# EAGLE design secondsBoard (EAGLE 5.11)
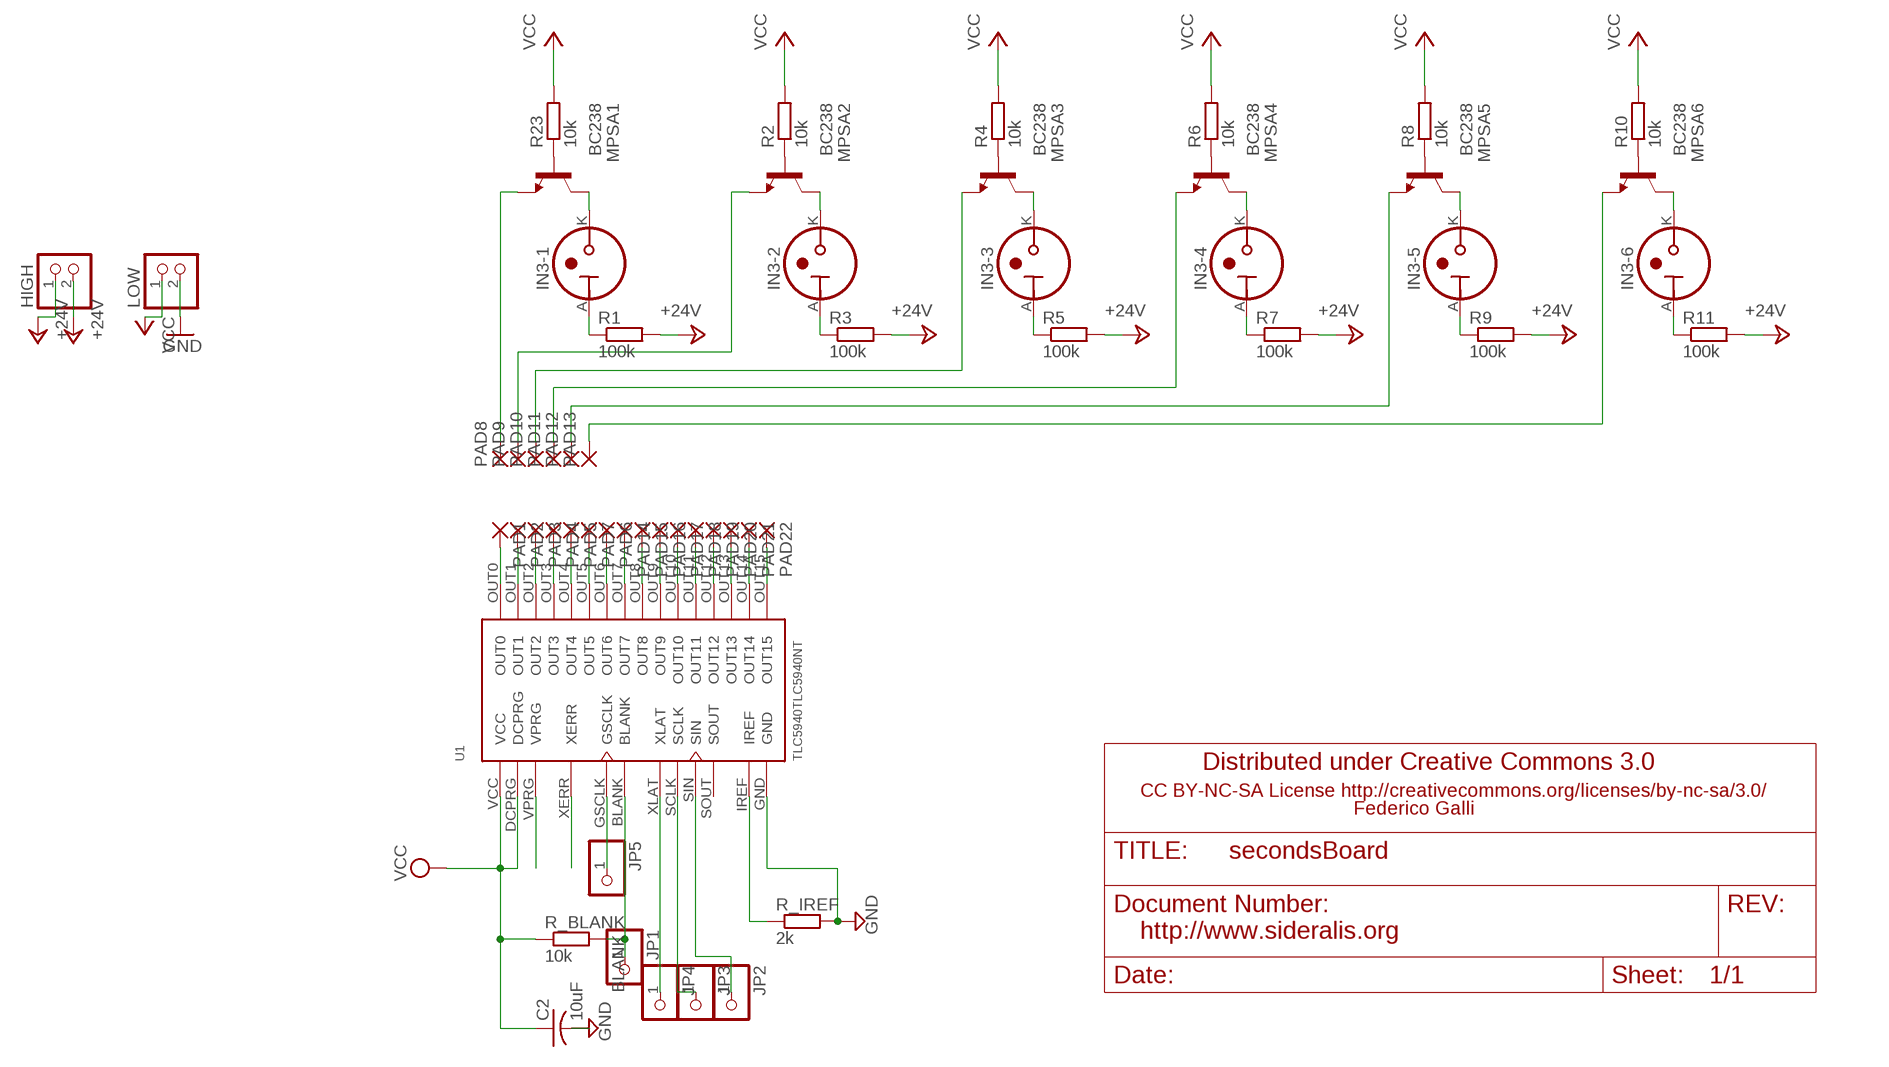
[diagram p0: schematic, sheet 1]

## Parts
C2  10uF  C-US025-025X050  [C025-025X050]
HIGH  PINHD-1X2  [1X02]
IN3-1  IN-3  [IN-3]
IN3-2  IN-3  [IN-3]
IN3-3  IN-3  [IN-3]
IN3-4  IN-3  [IN-3]
IN3-5  IN-3  [IN-3]
IN3-6  IN-3  [IN-3]
JP1  PINHD-1X1  [1X01]
JP2  PINHD-1X1  [1X01]
JP3  PINHD-1X1  [1X01]
JP4  PINHD-1X1  [1X01]
JP5  PINHD-1X1  [1X01]
LOW  PINHD-1X2  [1X02]
MPSA1  BC238  [TO92]
MPSA2  BC238  [TO92]
MPSA3  BC238  [TO92]
MPSA4  BC238  [TO92]
MPSA5  BC238  [TO92]
MPSA6  BC238  [TO92]
PAD1  2,15/1,0  [2,15/1,0]
PAD2  2,15/1,0  [2,15/1,0]
PAD3  2,15/1,0  [2,15/1,0]
PAD4  2,15/1,0  [2,15/1,0]
PAD5  2,15/1,0  [2,15/1,0]
PAD6  2,15/1,0  [2,15/1,0]
PAD7  2,15/1,0  [2,15/1,0]
PAD8  2,15/1,0  [2,15/1,0]
PAD9  2,15/1,0  [2,15/1,0]
PAD10  2,15/1,0  [2,15/1,0]
PAD11  2,15/1,0  [2,15/1,0]
PAD12  2,15/1,0  [2,15/1,0]
PAD13  2,15/1,0  [2,15/1,0]
PAD14  2,15/1,0  [2,15/1,0]
PAD15  2,15/1,0  [2,15/1,0]
PAD16  2,15/1,0  [2,15/1,0]
PAD17  2,15/1,0  [2,15/1,0]
PAD18  2,15/1,0  [2,15/1,0]
PAD19  2,15/1,0  [2,15/1,0]
PAD20  2,15/1,0  [2,15/1,0]
PAD21  2,15/1,0  [2,15/1,0]
PAD22  2,15/1,0  [2,15/1,0]
R1  100k  R-EU_0207/7  [0207/7]
R2  10k  R-EU_0207/7  [0207/7]
R3  100k  R-EU_0207/7  [0207/7]
R4  10k  R-EU_0207/7  [0207/7]
R5  100k  R-EU_0207/7  [0207/7]
R6  10k  R-EU_0207/7  [0207/7]
R7  100k  R-EU_0207/7  [0207/7]
R8  10k  R-EU_0207/7  [0207/7]
R9  100k  R-EU_0207/7  [0207/7]
R10  10k  R-EU_0207/7  [0207/7]
R11  100k  R-EU_0207/7  [0207/7]
R23  10k  R-EU_0207/7  [0207/7]
R_BLANK  10k  R-EU_0207/7  [0207/7]
R_IREF  2k  R-EU_0207/7  [0207/7]
U1  TLC5940TLC5940NT  [DIL28-3]

## Nets
+24V: HIGH.1 HIGH.2 R1.2 R3.2 R5.2 R7.2 R9.2 R11.2
BLANK: JP1.1 R_BLANK.2 U1.BLANK
GND: C2.2 LOW.2 R_IREF.2 U1.GND U1.VPRG
GSCLK: JP5.1 U1.GSCLK
N$1: IN3-1.K MPSA1.3(C)
N$2: IN3-1.A R1.1
N$3: U1.XERR
N$4: R_IREF.1 U1.IREF
N$5: MPSA2.2(B) R2.1
N$6: IN3-2.K MPSA2.3(C)
N$7: IN3-2.A R3.1
N$8: MPSA3.2(B) R4.1
N$9: IN3-3.K MPSA3.3(C)
N$10: IN3-3.A R5.1
N$11: MPSA4.2(B) R6.1
N$12: IN3-4.K MPSA4.3(C)
N$13: IN3-4.A R7.1
N$14: MPSA5.2(B) R8.1
N$15: IN3-5.K MPSA5.3(C)
N$16: IN3-5.A R9.1
N$17: MPSA6.2(B) R10.1
N$18: IN3-6.K MPSA6.3(C)
N$19: IN3-6.A R11.1
N$20: PAD1.1(P) U1.OUT0
N$21: PAD2.1(P) U1.OUT1
N$22: PAD3.1(P) U1.OUT2
N$23: PAD4.1(P) U1.OUT3
N$24: PAD5.1(P) U1.OUT4
N$25: PAD7.1(P) U1.OUT5
N$26: PAD22.1(P) U1.OUT15
N$27: PAD6.1(P) U1.OUT6
N$28: PAD14.1(P) U1.OUT7
N$53: MPSA1.2(B) R23.1
OUT1_BLUE: MPSA3.1(E) PAD10.1(P)
OUT1_GREEN: MPSA1.1(E) PAD8.1(P)
OUT1_GREEN1: MPSA2.1(E) PAD9.1(P)
OUT2_BLUE: MPSA6.1(E) PAD13.1(P)
OUT2_GREEN: MPSA4.1(E) PAD11.1(P)
OUT2_RED: MPSA5.1(E) PAD12.1(P)
OUT3_BLUE: PAD15.1(P) U1.OUT8
OUT4_BLUE: PAD18.1(P) U1.OUT11
OUT4_GREEN: PAD16.1(P) U1.OUT9
OUT4_RED: PAD17.1(P) U1.OUT10
OUT5_BLUE: PAD21.1(P) U1.OUT14
OUT5_GREEN: PAD19.1(P) U1.OUT12
OUT5_RED: PAD20.1(P) U1.OUT13
SCLK: JP3.1 U1.SCLK
SIN: JP2.1 U1.SIN
VCC: C2.1 LOW.1 R2.2 R4.2 R6.2 R8.2 R10.2 R23.2 R_BLANK.1 U1.DCPRG U1.VCC
XLAT: JP4.1 U1.XLAT
Unconnected: U1.SOUT

## Notes on the sheet
- Distributed under Creative Commons 3.0
- CC BY-NC-SA License http://creativecommons.org/licenses/by-nc-sa/3.0/
- Federico Galli
- http://www.sideralis.org

## Library data of the parts
C2 = adafruit:C-US: CAPACITOR, American symbol
HIGH LOW = pinhead:PINHD-1X2: PIN HEADER
IN3-1-IN3-6 = russian-nixies:IN-3: IN-3: nixie bulb
JP1-JP5 = adafruit:PINHD-1X1: Pin header 1x1 for 0.1" spacing With round pins
MPSA1-MPSA6 = transistor-npn:BC238: NPN Transistor
PAD1-PAD22 = wirepad:2,15/1,0: THROUGH-HOLE PAD
R1-R11 R23 = resistor:R-EU_: RESISTOR, European symbol
R_BLANK R_IREF = rcl:R-EU_: RESISTOR, European symbol
U1 = TLC5940NT:TLC5940

## Board
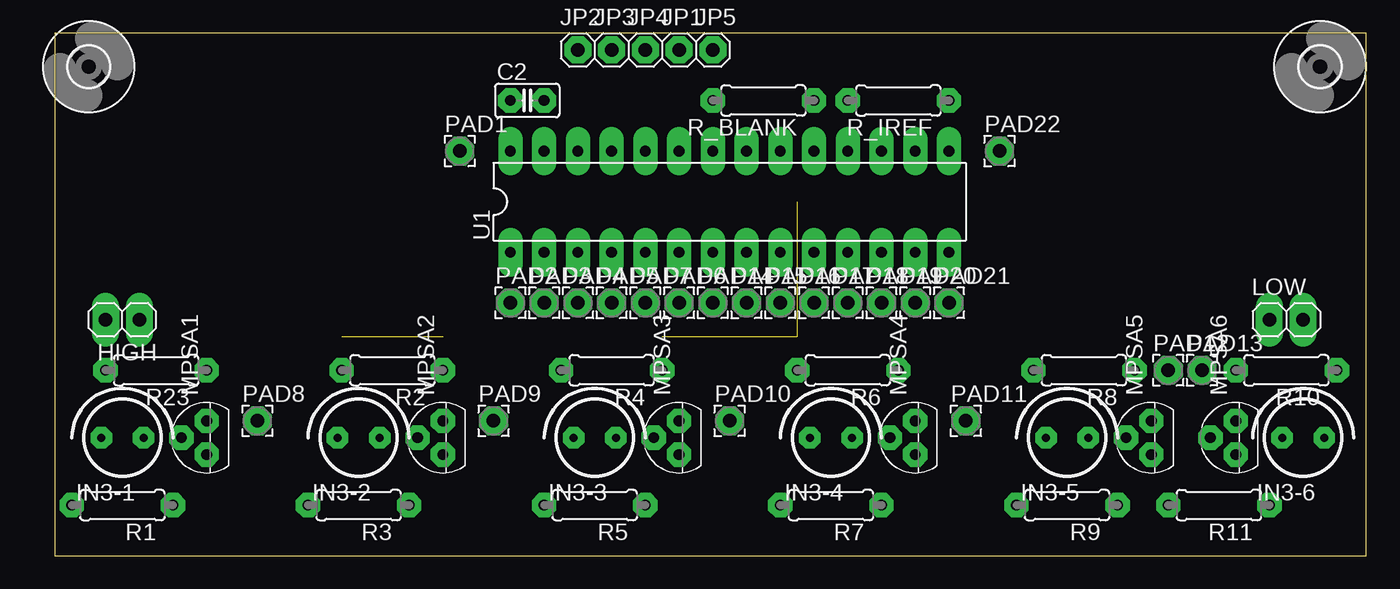
[diagram p1: board, top side]
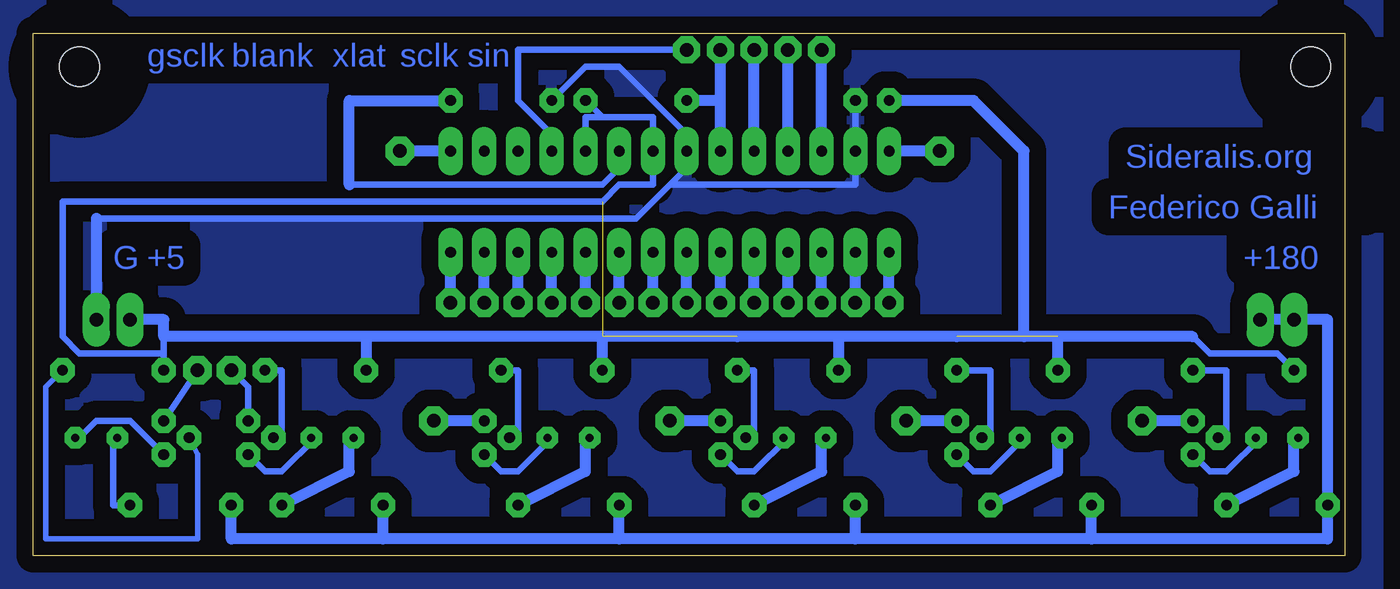
[diagram p2: board, bottom side, seen from below]

Size 98.73 x 39.36 mm. Coordinates in mm from the lower left corner, seen from the top.
Outline: 0,0 98.73,0 98.73,39.36 0,39.36 0,0
Copper layers (1*16): Top 0.035mm / dielectric 1.5mm / Bottom 0.035mm
Design rules "default *": minimum track width 20mil, minimum drill 24mil, track to track 8mil, track to pad 8mil, pad to pad 8mil, via to via 8mil, smd to smd 8mil, copper to edge 40mil, drill to drill 8mil, minimum pad ring 20mil, minimum via ring 8mil, stop-mask expansion 4mil, vias tented up to drill 0mil, thermal gap 10mil

### Footprints (pad centres in the part's own frame; a part is rotated, then mirrored left to right if it is on the bottom)
C025-025X050 = drill 0.813 pad 1.676 octagon: 1 -1.27,0; 2 1.27,0
1X02 = drill 1.016 long: 1 -1.27,0; 2 1.27,0
IN-3 = drill 0.6 octagon: A -1.587,0; K 1.587,0
1X01 = drill 1.016 pad 1.93 octagon: 1 0,0
TO92 = drill 0.813 octagon: 1 1.27,0; 2 0,1.905; 3 -1.27,0
2,15/1,0 = drill 1.016 pad 2.159 octagon: 1 0,0
0207/7 = drill 0.813 octagon: 1 -3.81,0; 2 3.81,0
DIL28-3 = drill 0.813 long: BLANK -3.81,3.81; DCPRG 6.35,3.81; GND -1.27,3.81; GSCLK 8.89,3.81; IREF 3.81,3.81; OUT0 -16.51,3.81; OUT1 -16.51,-3.81; OUT2 -13.97,-3.81; OUT3 -11.43,-3.81; OUT4 -8.89,-3.81; OUT5 -6.35,-3.81; OUT6 -3.81,-3.81; OUT7 -1.27,-3.81; OUT8 1.27,-3.81; OUT9 3.81,-3.81; OUT10 6.35,-3.81; OUT11 8.89,-3.81; OUT12 11.43,-3.81; OUT13 13.97,-3.81; OUT14 16.51,-3.81; OUT15 16.51,3.81; SCLK -8.89,3.81; SIN -11.43,3.81; SOUT 11.43,3.81; VCC 1.27,3.81; VPRG -13.97,3.81; XERR 13.97,3.81; XLAT -6.35,3.81
3,0 = hole 3: 0,0

### Placement (x,y rotation side)
C2  35.56,34.29 0 top
HIGH  5.08,17.78 180 top
IN3-1  5.08,8.89 0 top
IN3-2  22.86,8.89 0 top
IN3-3  40.64,8.89 0 top
IN3-4  58.42,8.89 0 top
IN3-5  76.2,8.89 0 top
IN3-6  93.98,8.89 0 top
JP1  46.99,38.1 0 top
JP2  39.37,38.1 0 top
JP3  41.91,38.1 0 top
JP4  44.45,38.1 0 top
JP5  49.53,38.1 0 top
LOW  92.71,17.78 0 top
MPSA1  11.43,8.89 90 top
MPSA2  29.21,8.89 90 top
MPSA3  46.99,8.89 90 top
MPSA4  64.77,8.89 90 top
MPSA5  82.55,8.89 90 top
MPSA6  88.9,8.89 90 top
PAD1  30.48,30.48 0 top
PAD2  34.29,19.05 0 top
PAD3  36.83,19.05 0 top
PAD4  39.37,19.05 0 top
PAD5  41.91,19.05 0 top
PAD6  46.99,19.05 0 top
PAD7  44.45,19.05 0 top
PAD8  15.24,10.16 0 top
PAD9  33.02,10.16 0 top
PAD10  50.8,10.16 0 top
PAD11  68.58,10.16 0 top
PAD12  83.82,13.97 0 top
PAD13  86.36,13.97 0 top
PAD14  49.53,19.05 0 top
PAD15  52.07,19.05 0 top
PAD16  54.61,19.05 0 top
PAD17  57.15,19.05 0 top
PAD18  59.69,19.05 0 top
PAD19  62.23,19.05 0 top
PAD20  64.77,19.05 0 top
PAD21  67.31,19.05 0 top
PAD22  71.12,30.48 0 top
R1  5.08,3.81 180 top
R2  25.4,13.97 180 top
R3  22.86,3.81 180 top
R4  41.91,13.97 180 top
R5  40.64,3.81 180 top
R6  59.69,13.97 180 top
R7  58.42,3.81 180 top
R8  77.47,13.97 180 top
R9  76.2,3.81 180 top
R10  92.71,13.97 180 top
R11  87.63,3.81 180 top
R23  7.62,13.97 180 top
R_BLANK  53.34,34.29 180 top
R_IREF  63.5,34.29 180 top
U1  50.8,26.67 0 top
U$1  [3,0]  2.54,36.83 0 top
U$2  [3,0]  95.25,36.83 0 top

### Tracks (layer width: path | path; a pad name or v marks a point on that pad's centre or on a via)
+24V
  Bottom 0.813: HIGH.1 HIGH.2 1.27,17.78 R1.2 1.27,1.27 19.05,1.27 | 19.05,1.27 R3.2 | 19.05,1.27 36.83,1.27 | 36.83,1.27 R5.2 | 36.83,1.27 54.61,1.27 | 54.61,1.27 R7.2 | 54.61,1.27 72.39,1.27 | 72.39,1.27 R9.2 | 72.39,1.27 83.82,1.27 R11.2
BLANK
  Bottom 0.813: U1.BLANK 46.99,34.29 | 46.99,34.29 JP1.1 | 46.99,34.29 R_BLANK.2
BOTTOM
  pour Bottom (isolate 1.27): -2.54,43.18 101.6,43.18 101.6,-5.08 -2.54,-5.08
GND
  Bottom 0.508: C2.2 U1.VPRG 36.83,27.94 50.8,27.94 | R_IREF.2 57.15,36.83 54.61,36.83 49.53,31.75 U1.GND 49.53,29.21 50.8,27.94 | 93.98,25.4 53.34,25.4 50.8,27.94
  Bottom 0.813: 93.98,25.4 LOW.2
  pour Bottom (isolate 1.27): 101.6,41.91 101.6,-2.54 -2.54,-2.54 -2.54,41.91 0,41.91
GSCLK
  Bottom 0.508: U1.GSCLK 59.69,31.75 62.23,34.29 62.23,38.1 JP5.1
N$1
  Bottom 0.508: MPSA1.3 10.16,6.35 8.89,6.35 6.35,8.89 IN3-1.K
N$2
  Bottom 0.508: 3.81,8.89 IN3-1.A
  Bottom 0.813: 3.81,8.89 3.81,6.35 R1.1
N$4
  Bottom 0.508: U1.IREF 54.61,29.21 55.88,27.94 74.93,27.94
  Bottom 0.813: R_IREF.1 74.93,34.29 74.93,27.94
N$5
  Bottom 0.508: R2.1 26.67,13.97 26.67,8.89 MPSA2.2
N$6
  Bottom 0.508: MPSA2.3 27.94,6.35 26.67,6.35 24.13,8.89 IN3-2.K
N$7
  Bottom 0.508: 21.59,8.89 IN3-2.A
  Bottom 0.813: 21.59,8.89 21.59,6.35 R3.1
N$8
  Bottom 0.508: R4.1 44.45,13.97 44.45,8.89 MPSA3.2
N$9
  Bottom 0.508: MPSA3.3 45.72,6.35 44.45,6.35 41.91,8.89 IN3-3.K
N$10
  Bottom 0.508: 39.37,8.89 IN3-3.A
  Bottom 0.813: 39.37,8.89 39.37,6.35 R5.1
N$11
  Bottom 0.508: R6.1 62.23,13.97 62.23,8.89 MPSA4.2
N$12
  Bottom 0.508: MPSA4.3 63.5,6.35 62.23,6.35 59.69,8.89 IN3-4.K
N$13
  Bottom 0.508: 57.15,8.89 IN3-4.A
  Bottom 0.813: 57.15,8.89 57.15,6.35 R7.1
N$14
  Bottom 0.508: R8.1 80.01,13.97 80.01,8.89 MPSA5.2
N$15
  Bottom 0.508: MPSA5.3 81.28,6.35 80.01,6.35 77.47,8.89 IN3-5.K
N$16
  Bottom 0.508: 74.93,8.89 IN3-5.A
  Bottom 0.813: 74.93,8.89 74.93,6.35 R9.1
N$17
  Bottom 0.406: MPSA6.2 86.36,7.62 86.36,1.27 97.79,1.27 97.79,12.7 R10.1
N$18
  Bottom 0.508: MPSA6.3 91.44,10.16 93.98,10.16 95.25,8.89 IN3-6.K
N$19
  Bottom 0.508: R11.1 92.71,3.81 92.71,8.89 IN3-6.A
N$20
  Bottom 0.813: PAD1.1 U1.OUT0
N$21
  Bottom 0.813: PAD2.1 U1.OUT1
N$22
  Bottom 0.813: PAD3.1 U1.OUT2
N$23
  Bottom 0.813: PAD4.1 U1.OUT3
N$24
  Bottom 0.813: PAD5.1 U1.OUT4
N$25
  Bottom 0.813: PAD7.1 U1.OUT5
N$26
  Bottom 0.813: U1.OUT15 PAD22.1
N$27
  Bottom 0.813: PAD6.1 U1.OUT6
N$28
  Bottom 0.813: PAD14.1 U1.OUT7
N$53
  Bottom 0.508: R23.1 8.89,13.97 8.89,8.89 MPSA1.2
OUT1_BLUE
  Bottom 0.813: MPSA3.1 PAD10.1
OUT1_GREEN
  Bottom 0.813: MPSA1.1 PAD8.1
OUT1_GREEN1
  Bottom 0.813: MPSA2.1 PAD9.1
OUT2_BLUE
  Bottom 0.508: PAD13.1 MPSA6.1
OUT2_GREEN
  Bottom 0.813: MPSA4.1 PAD11.1
OUT2_RED
  Bottom 0.508: MPSA5.1 82.55,12.7 PAD12.1
OUT3_BLUE
  Bottom 0.813: PAD15.1 U1.OUT8
OUT4_BLUE
  Bottom 0.813: PAD18.1 U1.OUT11
OUT4_GREEN
  Bottom 0.813: PAD16.1 U1.OUT9
OUT4_RED
  Bottom 0.813: PAD17.1 U1.OUT10
OUT5_BLUE
  Bottom 0.813: PAD21.1 U1.OUT14
OUT5_GREEN
  Bottom 0.813: PAD19.1 U1.OUT12
OUT5_RED
  Bottom 0.813: PAD20.1 U1.OUT13
SCLK
  Bottom 0.813: U1.SCLK JP3.1
SIN
  Bottom 0.813: U1.SIN JP2.1
VCC  (4 unrouted)
  Bottom 0.508: R23.2 5.08,15.24 10.16,15.24 11.43,16.51 | 55.88,33.02 52.07,33.02 U1.VCC 52.07,27.94 54.61,27.94 55.88,26.67 96.52,26.67 96.52,16.51 95.25,15.24 88.9,15.24 | 55.88,33.02 R_BLANK.1 | U1.DCPRG 57.15,33.02 55.88,33.02 | 88.9,16.51 88.9,15.24 | 88.9,15.24 R10.2
  Bottom 0.813: 24.13,16.51 24.13,30.48 27.94,34.29 C2.1 | R2.2 21.59,16.51 | R6.2 55.88,16.51 | 73.66,16.51 R8.2 | 29.21,16.51 38.1,16.51 | 38.1,16.51 45.72,16.51 | 38.1,16.51 R4.2 | 11.43,16.51 73.66,16.51 | 73.66,16.51 88.9,16.51 88.9,17.78 LOW.1
XLAT
  Bottom 0.813: U1.XLAT JP4.1

### Text on the board
Bottom: sin | sclk | xlat | blank | gsclk | Sideralis.org | Federico Galli | +180 | +5 | G